# EAGLE design board_1.4(FixMosfetGND)v (EAGLE 7.7.0)
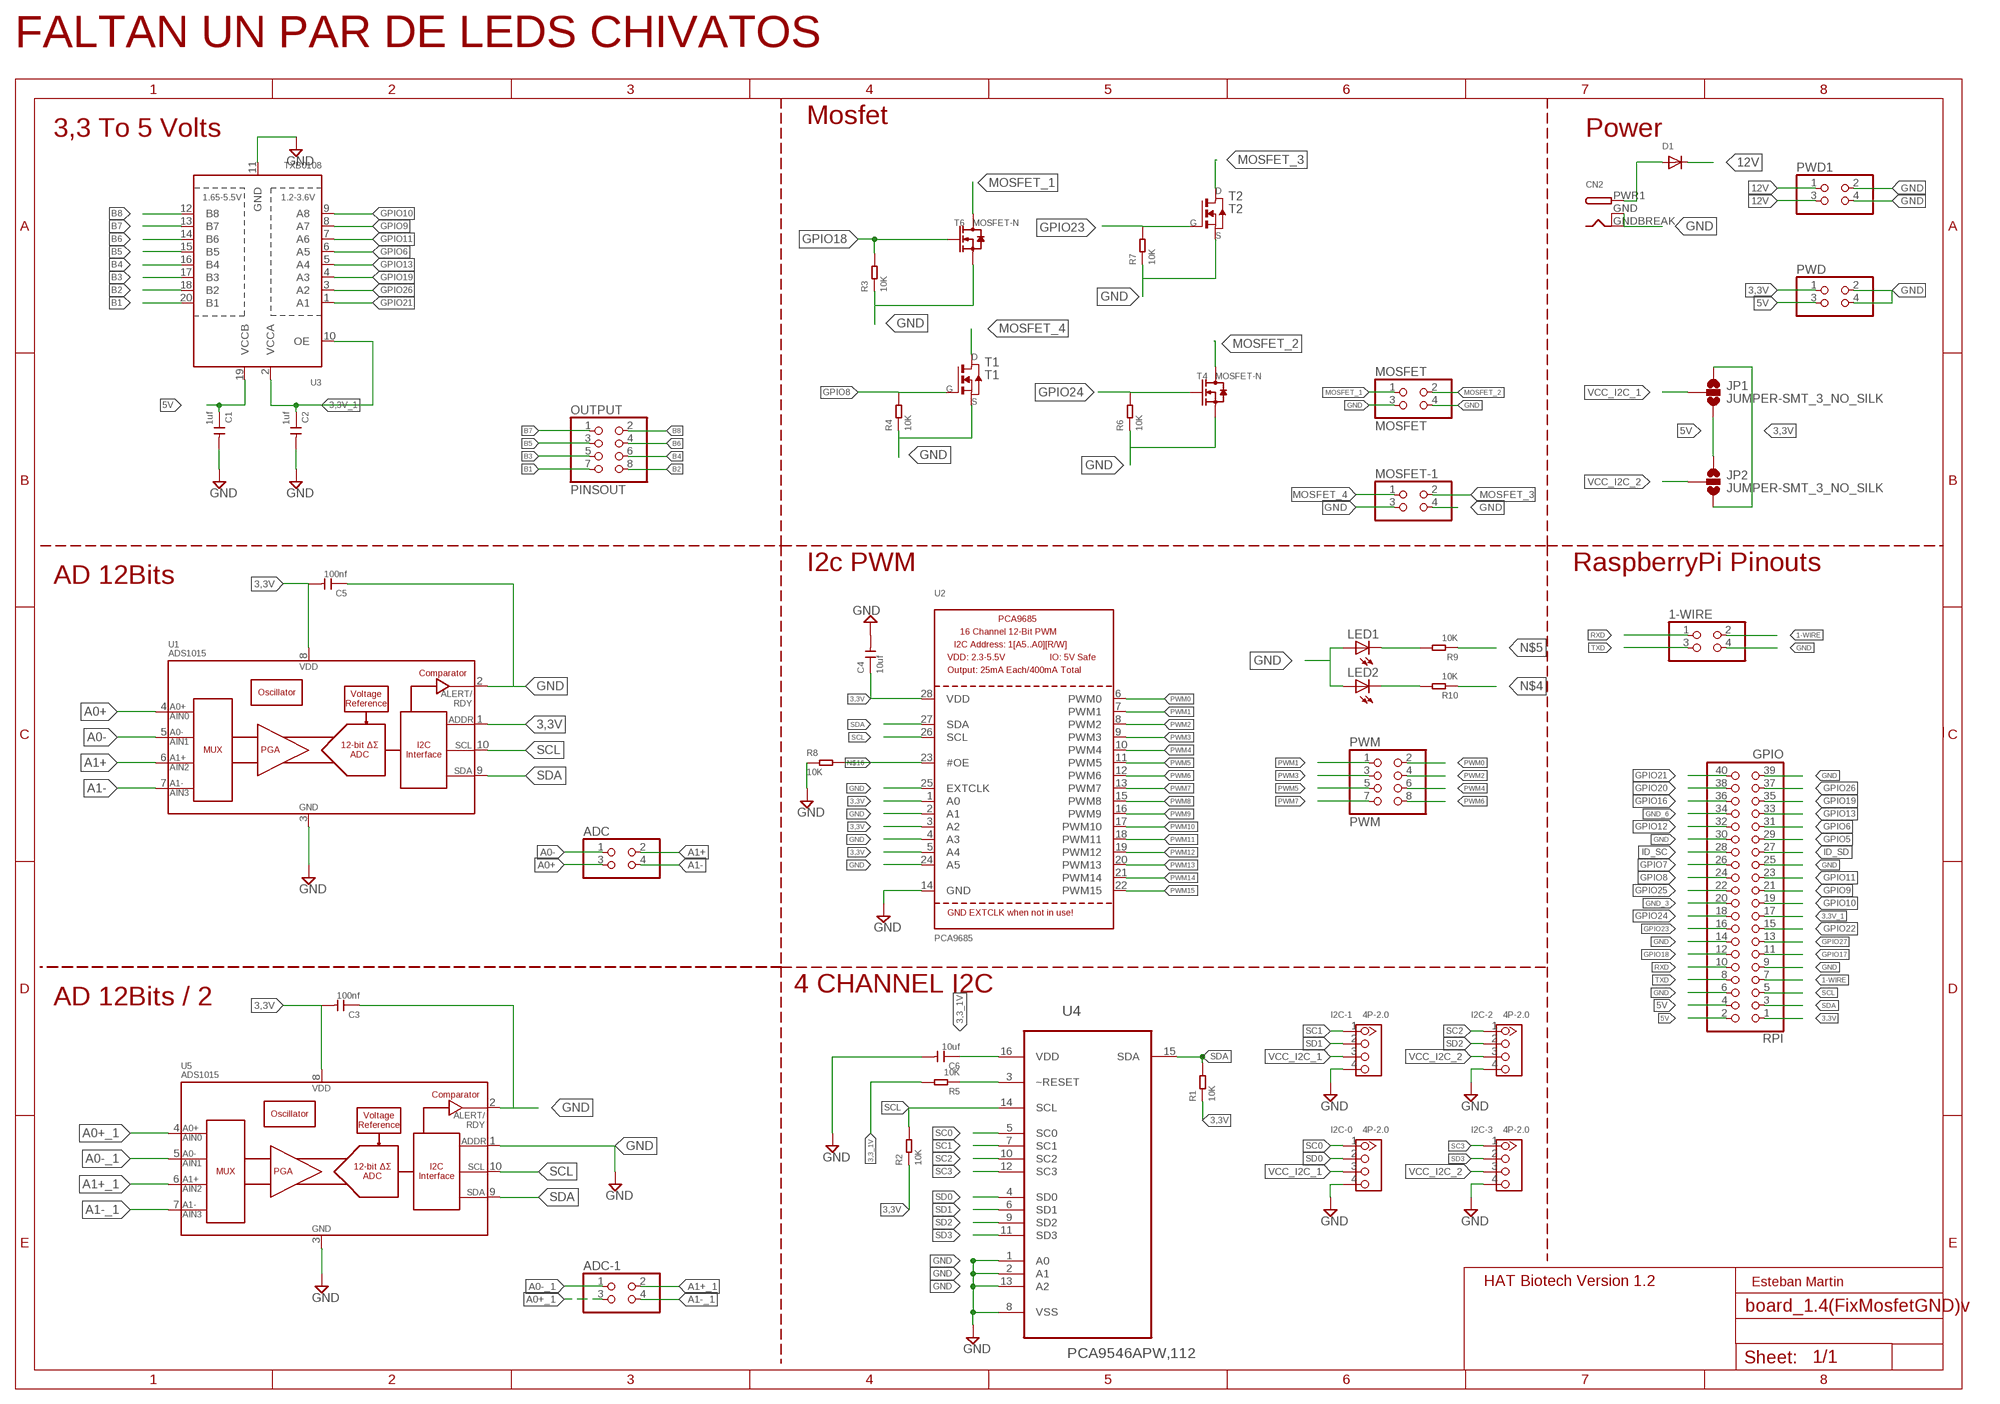
[diagram p0: schematic, sheet 1]

## Parts
1-WIRE  PINHD-2X2  [2X02]
ADC  PINHD-2X2  [2X02]
ADC-1  PINHD-2X2  [2X02]
C1  1uf  CERAMIC-1UF-25V-10%-X7R(0805)  [C0805]
C2  1uf  CERAMIC-1UF-25V-10%-X7R(0805)  [C0805]
C3  100nf  CERAMIC-100NF-50V-10%-X7R(0805)  [C0805]
C4  10uf  CERAMIC-1UF-25V-10%-X7R(0805)  [C0805]
C5  100nf  CERAMIC-100NF-50V-10%-X7R(0805)  [C0805]
C6  10uf  CERAMIC-1UF-25V-10%-X7R(0805)  [C0805]
CN2  DCBARRELSMT  [DCJACK_2MM_SMT]
D1  DIODESOD-123  [SOD-123]
I2C-0  4P-2.0  GROVE-CONNECTOR-DIP(4P-2.0)  [HW4-2.0]
I2C-1  4P-2.0  GROVE-CONNECTOR-DIP(4P-2.0)  [HW4-2.0]
I2C-2  4P-2.0  GROVE-CONNECTOR-DIP(4P-2.0)  [HW4-2.0]
I2C-3  4P-2.0  GROVE-CONNECTOR-DIP(4P-2.0)  [HW4-2.0]
JP1  JUMPER-SMT_3_NO_SILK  [SMT-JUMPER_3_NO_SILK]
JP2  JUMPER-SMT_3_NO_SILK  [SMT-JUMPER_3_NO_SILK]
LED1  LED  [SMARTLED-TTW]
LED2  LED  [SMARTLED-TTW]
MOSFET  MOSFET  PINHD-2X2  [2X02]
MOSFET-1  PINHD-2X2  [2X02]
OUTPUT  PINSOUT  PINHD-2X4  [2X04]
PWD  PINHD-2X2  [2X02]
PWD1  PINHD-2X2  [2X02]
PWM  PWM  PINHD-2X4  [2X04]
R1  10K  SMD-RES-10K-1%-1/8W(0805)  [R0805]
R2  10K  SMD-RES-10K-1%-1/8W(0805)  [R0805]
R3  10K  SMD-RES-10K-1%-1/8W(0805)  [R0805]
R4  10K  SMD-RES-10K-1%-1/8W(0805)  [R0805]
R5  10K  SMD-RES-10K-1%-1/8W(0805)  [R0805]
R6  10K  SMD-RES-10K-1%-1/8W(0805)  [R0805]
R7  10K  SMD-RES-10K-1%-1/8W(0805)  [R0805]
R8  10K  SMD-RES-10K-1%-1/8W(0805)  [R0805]
R9  10K  SMD-RES-10K-1%-1/8W(0805)  [R0805]
R10  10K  SMD-RES-10K-1%-1/8W(0805)  [R0805]
RPI  GPIO  PINHD-2X20  [2X20]
T1  T1  NMOSFETTO252  [TO252]
T2  T2  NMOSFETTO252  [TO252]
T4  MOSFET-N  [SOT-23]
T6  MOSFET-N  [SOT-23]
U1  ADS1015  [MSOP10]
U2  PCA9685  [TSSOP28]
U3  TXB0108  TXB0108PWR  [TSSOP20]
U4  PCA9546APW,112  [SOP65P640X110-16N]
U5  ADS1015  [MSOP10]

## Nets
1-WIRE: 1-WIRE.2 RPI.7
3,3_1V: C6.1 R5.2 U4.16(VDD)
3,3V: C3.2 C4.1 C5.2 JP1.1 JP2.3 PWD.1 R1.1 R2.1 RPI.1 U1.1(ADDR) U1.8(VDD) U2.1(A0) U2.3(A2) U2.5(A4) U2.28(VDD) U5.8(VDD)
3,3V_1: C2.1 RPI.17 U3.2(VCCA) U3.10(OE)
5V: C1.1 JP1.3 JP2.1 PWD.3 RPI.2 RPI.4 U3.19(VCCB)
12V: D1.C PWD1.1 PWD1.3
A0+: ADC.3 U1.4(AIN0)
A0+_1: ADC-1.3 U5.4(AIN0)
A0-: ADC.1 U1.5(AIN1)
A0-_1: ADC-1.1 U5.5(AIN1)
A1+: ADC.2 U1.6(AIN2)
A1+_1: ADC-1.2 U5.6(AIN2)
A1-: ADC.4 U1.7(AIN3)
A1-_1: ADC-1.4 U5.7(AIN3)
B1: OUTPUT.7 U3.20(B1)
B2: OUTPUT.8 U3.18(B2)
B3: OUTPUT.5 U3.17(B3)
B4: OUTPUT.6 U3.16(B4)
B5: OUTPUT.3 U3.15(B5)
B6: OUTPUT.4 U3.14(B6)
B7: OUTPUT.1 U3.13(B7)
B8: OUTPUT.2 U3.12(B8)
GND: 1-WIRE.4 C1.2 C2.2 C3.1 C4.2 C5.1 C6.2 CN2.GND(GNDBREAK) CN2.GNDBREAK(GND) I2C-0.4 I2C-1.4 I2C-2.4 I2C-3.4 LED1.A@1(A) LED2.A@1(A) MOSFET-1.3 MOSFET-1.4 MOSFET.3 MOSFET.4 PWD1.2 PWD1.4 PWD.2 PWD.4 R3.1 R4.1 R6.1 R7.1 R8.1 RPI.6 RPI.9 RPI.14 RPI.25 RPI.30 RPI.39 T1.2(S) T2.2(S) T4.2(S) T6.2(S) U1.2(ALERT/RDY) U1.3(VSS) U2.2(A1) U2.4(A3) U2.14(GND) U2.24(A5) U2.25(EXTCLK) U3.11(GND) U4.1(A0) U4.2(A1) U4.8(VSS) U4.13(A2) U5.1(ADDR) U5.2(ALERT/RDY) U5.3(VSS)
GND_3: RPI.20
GND_6: RPI.34
GPIO5: RPI.29
GPIO6: RPI.31 U3.6(A5)
GPIO7: RPI.26
GPIO8: R4.2 RPI.24 T1.1(G)
GPIO9: RPI.21 U3.8(A7)
GPIO10: RPI.19 U3.9(A8)
GPIO11: RPI.23 U3.7(A6)
GPIO12: RPI.32
GPIO13: RPI.33 U3.5(A4)
GPIO16: RPI.36
GPIO17: RPI.11
GPIO18: R3.2 RPI.12 T6.1(G)
GPIO19: RPI.35 U3.4(A3)
GPIO20: RPI.38
GPIO21: RPI.40 U3.1(A1)
GPIO22: RPI.15
GPIO23: R7.2 RPI.16 T2.1(G)
GPIO24: R6.2 RPI.18 T4.1(G)
GPIO25: RPI.22
GPIO26: RPI.37 U3.3(A2)
GPIO27: RPI.13
ID_SC: RPI.28
ID_SD: RPI.27
MOSFET_1: MOSFET.1 T6.3(D)
MOSFET_2: MOSFET.2 T4.3(D)
MOSFET_3: MOSFET-1.2 T2.3(D)
MOSFET_4: MOSFET-1.1 T1.3(D)
N$1: LED1.C@1(C) R9.2
N$2: CN2.PWR1(PWR) D1.A
N$3: LED2.C@1(C) R10.2
N$4: R10.1
N$5: R9.1
N$7: R5.1 U4.3(~RESET)
N$16: R8.2 U2.23(#OE)
PWM0: PWM.2 U2.6(PWM0)
PWM1: PWM.1 U2.7(PWM1)
PWM2: PWM.4 U2.8(PWM2)
PWM3: PWM.3 U2.9(PWM3)
PWM4: PWM.6 U2.10(PWM4)
PWM5: PWM.5 U2.11(PWM5)
PWM6: PWM.8 U2.12(PWM6)
PWM7: PWM.7 U2.13(PWM7)
PWM8: U2.15(PWM8)
PWM9: U2.16(PWM9)
PWM10: U2.17(PWM10)
PWM11: U2.18(PWM11)
PWM12: U2.19(PWM12)
PWM13: U2.20(PWM13)
PWM14: U2.21(PWM14)
PWM15: U2.22(PWM15)
RXD: 1-WIRE.1 RPI.10
SC0: I2C-0.1 U4.5(SC0)
SC1: I2C-1.1 U4.7(SC1)
SC2: I2C-2.1 U4.10(SC2)
SC3: I2C-3.1 U4.12(SC3)
SCL: R2.2 RPI.5 U1.10(SCL) U2.26(SCL) U4.14(SCL) U5.10(SCL)
SD0: I2C-0.2 U4.4(SD0)
SD1: I2C-1.2 U4.6(SD1)
SD2: I2C-2.2 U4.9(SD2)
SD3: I2C-3.2 U4.11(SD3)
SDA: R1.2 RPI.3 U1.9(SDA) U2.27(SDA) U4.15(SDA) U5.9(SDA)
TXD: 1-WIRE.3 RPI.8
VCC_I2C_1: I2C-0.3 I2C-1.3 JP1.2
VCC_I2C_2: I2C-2.3 I2C-3.3 JP2.2

## Notes on the sheet
- FALTAN UN PAR DE LEDS CHIVATOS
- Mosfet
- 3,3 To 5 Volts | Power
- I2c PWM | RaspberryPi Pinouts
- AD 12Bits
- 4 CHANNEL I2C
- AD 12Bits / 2
- HAT Biotech Version 1.2 | Esteban Martin

## Library data of the parts
1-WIRE ADC ADC-1 MOSFET MOSFET-1 PWD PWD1 = pinhead:PINHD-2X2: PIN HEADER
C1 C2 = Seeed-OPL-Capacitor:CERAMIC-1UF-25V-10%-X7R(0805): 302010179; MPN: CC0805KKX7R8BB105
C3 C5 = Seeed-OPL-Capacitor:CERAMIC-100NF-50V-10%-X7R(0805): 302010165; MPN: CC0805KRX7R9BB104
C4 C6 = Seeed-OPL-Capacitor:CERAMIC-1UF-25V-10%-X7R(0805): 302010179; MPN: CC0805KKX7R8BB105; VALUE: 1uf
CN2 = adafruit:DCBARREL: 2.0mm DC Barrel Jack DCJACK_2MM_PTH - Through Hole Jack (4UConnector: 05537)
D1 = adafruit:DIODE: Diode SMADIODE - SMA Surface Mount Package 20V 1A Schottky Diode Digikey: 641-1014-6-ND DO-1N4148 - Through Hole Small Current Diode SOD-123 20V 1 A (.5mV Vf) Schottky Diode - Digikey: MBRX120TPMSCT-ND SOD-323 10V 570mA (.38mV Vf, 3ns) Schottky Diode - Digikey: ZLLS410CT-ND SOD-523 30V 30mA Schottky Diode (RB751S-40TE61) - Digikey: RB751S-40TE61CT-ND SOT23-R/W - SOT23 Package (R = Solder Paste/Reflow Ovens, W = Hand-Soldering) BAT54Film 40V 300mA - Digikey: 497-7162-1-ND
I2C-0 I2C-1-I2C-3 = Seeed-OPL-Connector:GROVE-CONNECTOR-DIP(4P-2.0): 320110033
JP1 JP2 = SparkFun-Jumpers:JUMPER-SMT_3_NO: Normally open jumper This jumper has three pads in close proximity to each other. Apply solder to close the connection(s).
LED1 LED2 = adafruit:LED: LED OSRAM: - CHIPLED LG R971, LG N971, LY N971, LG Q971, LY Q971, LO R971, LY R971 LH N974, LH R974 LS Q976, LO Q976, LY Q976 LO Q996 - Hyper CHIPLED LW Q18S LB Q993, LB Q99A, LB R99A - SideLED LS A670, LO A670, LY A670, LG A670, LP A670 LB A673, LV A673, LT A673, LW A673 LH A674 LY A675 LS A676, LA A676, LO A676, LY A676, LW A676 LS A679, LY A679, LG A679 - Hyper Micro SIDELED® LS Y876, LA Y876, LO Y876, LY Y876 LT Y87S - SmartLED LW L88C, LW L88S LB L89C, LB L89S, LG L890 LS L89K, LO L89K, LY L89K LS L896, LA L896, LO L896, LY L896 - TOPLED LS T670, LO T670, LY T670, LG T670, LP T670 LSG T670, LSP T670, LSY T670, LOP T670, LYG T670 LG T671, LOG T671, LSG T671 LB T673, LV T673, LT T673, LW T673 LH T674 LS T676, LA T676, LO T676, LY T676, LB T676, LH T676, LSB T676, LW T676 LB T67C, LV T67C, LT T67C, LS T67K, LO T67K, LY T67K, LW E67C LS E67B, LA E67B, LO E67B, LY E67B, LB E67C, LV E67C, LT E67C LW T67C LS T679, LY T679, LG T679 LS T770, LO T770, LY T770, LG T770, LP T770 LB T773, LV T773, LT T773, LW T773 LH T774 LS E675, LA E675, LY E675, LS T675 LS T776, LA T776, LO T776, LY T776, LB T776 LHGB T686 LT T68C, LB T68C - Hyper Mini TOPLED® LB M676 - Mini TOPLED Santana® LG M470 LS M47K, LO M47K, LY M47K Source: http://www.osram.convergy.de/
OUTPUT PWM = adafruit:PINHD-2X4: PIN HEADER
R1-R10 = Seeed-OPL-Resistor:SMD-RES-10K-1%-1/8W(0805): 301010361; MPN: RC0805FR-0710KL
RPI = adafruit:PINHD-2X20: PIN HEADER
T1 T2 = fab_2:NMOSFET: MOS FET
T4 T6 = Seeed-OPL-Transistor:MOSFET-N
U1 U5 = SparkFun-IC-Conversion:ADS1015: ADS1015 12-BIT ADC 12-Bit Del-Sig ADC Four single-ended inputs or two differential inputs Internal PGA I2C interface 2.0-5.5V SparkFun Products SparkFun Block for Intel Edison - ADC <https://www.sparkfun.com/products/13770> (DEV-13770); PROD_ID: IC-12270
U2 = adafruit:PCA9685: PCA9685 - 16 Channel 12-Bit I2C PWM Controller 5.0V tolerant 16 channel, 12-bit I2C PWM controller with 25mA per output (max. 400mA total) Digikey: 568-5931-1-ND
U3 = adafruit:TXB0108PWR: 8-Bit Bi-Directional Level Shifter 1.2V-3.6V (VCCA) to 1.65V-5.5V (VCCB) bi-directional level shifter with auto direction sensing. Max data rate - VCCA 1.8V: 20Mbps (50ns), VCCA 3.3V: 100Mbps (10ns) Digikey: 296-21527-1-ND
U4 = NXP_By_element14_Batch_1:PCA9546APW,112: 4-channel I2C-bus switch with reset; MPN: PCA9546APW,112; OC_FARNELL: 1831208; OC_NEWARK: 70R6610; PACKAGE: TSSOP-16; SUPPLIER: NXP

## Board
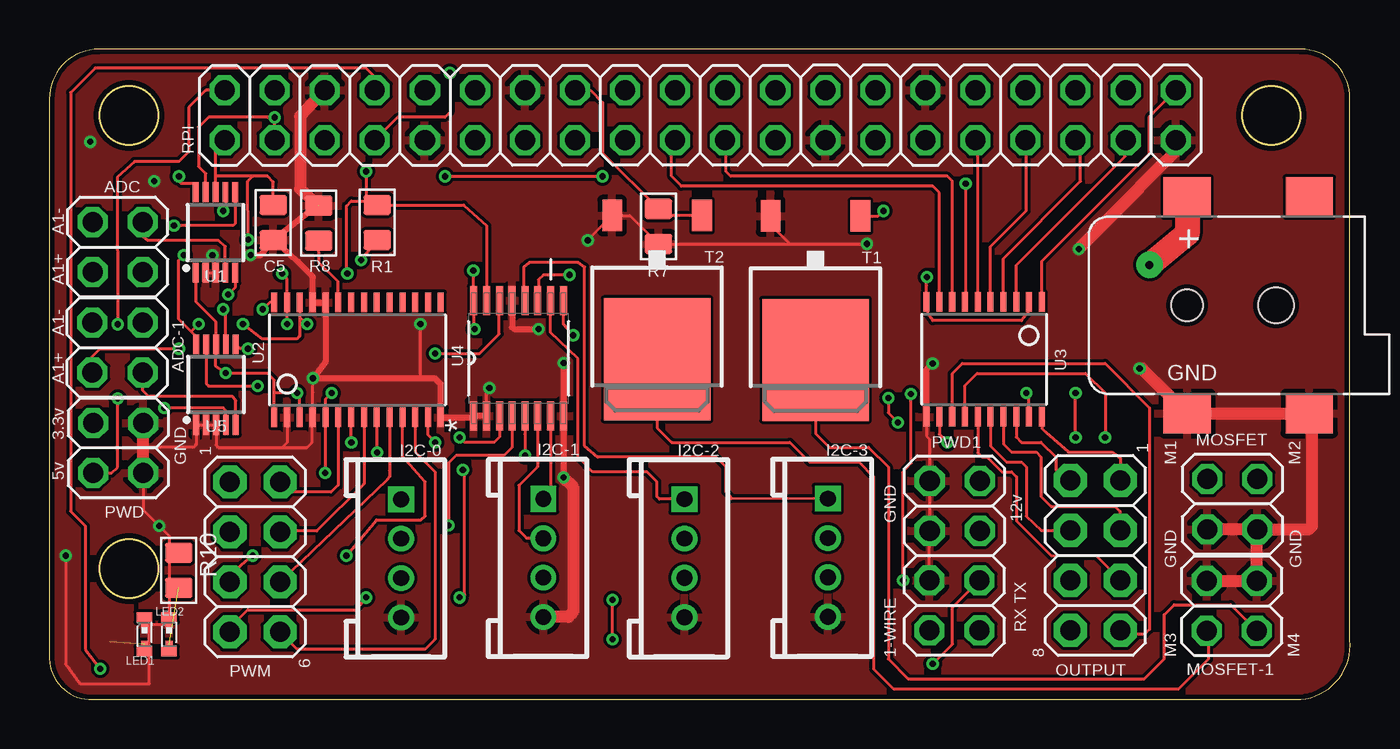
[diagram p1: board, top side]
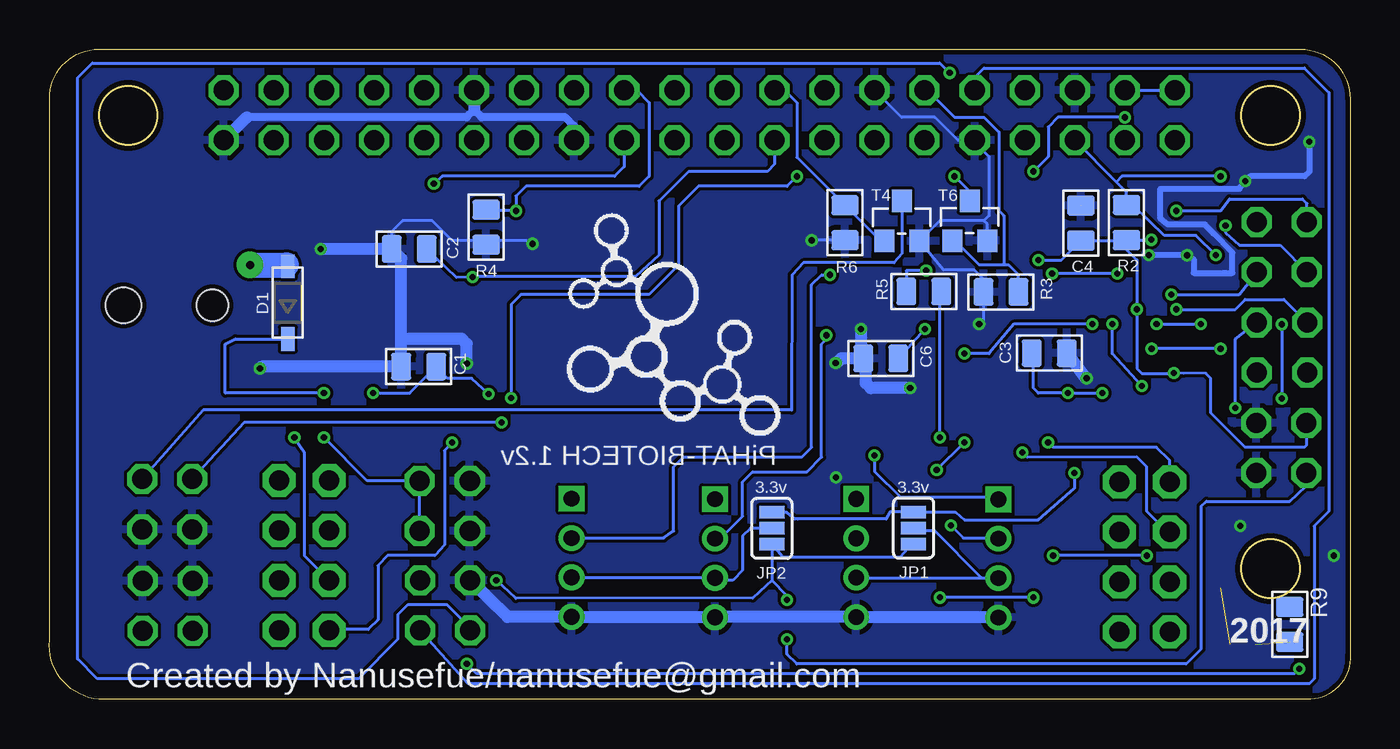
[diagram p2: board, bottom side, seen from below]

Size 66.01 x 33 mm. Coordinates in mm from the lower left corner, seen from the top.
Outline: 0,30.5 0,2.25 arc90 2,0 63.5,0 arc90 66,3 66,30.5 arc90 63.5,33 2.5,33 arc90 0,30.5
Outline: circle at 62.01,29.64 radius 1.48
Outline: circle at 4.05,29.64 radius 1.48
Outline: circle at 4.05,6.63 radius 1.48
Copper layers (1*16): Top 0.035mm / dielectric 1.5mm / Bottom 0.035mm
Design rules "SeeedStudio_2layer_DRU_no_angle_20140221": minimum track width 6mil, minimum drill 12mil, track to track 6mil, track to pad 6mil, pad to pad 6mil, via to via 6mil, smd to smd 0mil, copper to edge 10mil, drill to drill 10mil, minimum pad ring 10mil, minimum via ring 6mil, stop-mask expansion 2mil, vias tented up to drill 100mil, thermal gap 10mil

### Footprints (pad centres in the part's own frame; a part is rotated, then mirrored left to right if it is on the bottom)
2X02 = drill 1.016 octagon: 1 -1.27,-1.27; 2 -1.27,1.27; 3 1.27,-1.27; 4 1.27,1.27
C0805 = smd 1.397 x 1.016: 1 0,0.889; 2 0,-0.889
DCJACK_2MM_SMT = smd 2.4 x 2: GND 0,-5.5; GNDBREAK 6.2,-5.5; PWR1 0,5.5; PWR2 6.2,5.5 | hole 1.6: 0,0 | hole 1.8: 4.5,0
SOD-123 = smd 1.2 x 0.7: A 1.85,0; C -1.85,0
HW4-2.0 = drill 0.8 pad 1.27 square: 1 -3,0 | drill 0.8 pad 1.27: 2 -1,0; 3 1,0; 4 3,0
SMT-JUMPER_3_NO_SILK = smd 0.635 x 1.27: 1 -0.813,0; 2 0,0; 3 0.813,0
SMARTLED-TTW = smd 0.8 x 0.5: A 0,-0.875; C 0,0.875 | smd 0.35 x 0.35: A@1 0,-0.5; C@1 0,0.5
2X04 = drill 1.016 pad 1.676 octagon: 1 -3.81,-1.27; 2 -3.81,1.27; 3 -1.27,-1.27; 4 -1.27,1.27; 5 1.27,-1.27; 6 1.27,1.27; 7 3.81,-1.27; 8 3.81,1.27
R0805 = smd 1.397 x 1.016: 1 0,0.889; 2 0,-0.889
2X20 = drill 1.016 octagon: 1 -24.13,-1.27; 2 -24.13,1.27; 3 -21.59,-1.27; 4 -21.59,1.27; 5 -19.05,-1.27; 6 -19.05,1.27; 7 -16.51,-1.27; 8 -16.51,1.27; 9 -13.97,-1.27; 10 -13.97,1.27; 11 -11.43,-1.27; 12 -11.43,1.27; 13 -8.89,-1.27; 14 -8.89,1.27; 15 -6.35,-1.27; 16 -6.35,1.27; 17 -3.81,-1.27; 18 -3.81,1.27; 19 -1.27,-1.27; 20 -1.27,1.27; 21 1.27,-1.27; 22 1.27,1.27; 23 3.81,-1.27; 24 3.81,1.27; 25 6.35,-1.27; 26 6.35,1.27; 27 8.89,-1.27; 28 8.89,1.27; 29 11.43,-1.27; 30 11.43,1.27; 31 13.97,-1.27; 32 13.97,1.27; 33 16.51,-1.27; 34 16.51,1.27; 35 19.05,-1.27; 36 19.05,1.27; 37 21.59,-1.27; 38 21.59,1.27; 39 24.13,-1.27; 40 24.13,1.27
TO252 = smd 1 x 1.6: 1 -2.28,-4.8; 2 2.28,-4.8 | smd 5.4 x 6.2: 3 0,2.5
SOT-23 = smd 1.016 x 1.143: 1 -0.889,-1.016; 2 0.889,-1.016; 3 0,1.016
MSOP10 = smd 0.3 x 1: 1 -1,-2.05; 2 -0.5,-2.05; 3 0,-2.05; 4 0.5,-2.05; 5 1,-2.05; 6 1,2.05; 7 0.5,2.05; 8 0,2.05; 9 -0.5,2.05; 10 -1,2.05
TSSOP28 = smd 0.305 x 0.991: 1 -4.225,-2.918; 2 -3.575,-2.918; 3 -2.925,-2.918; 4 -2.275,-2.918; 5 -1.625,-2.918; 6 -0.975,-2.918; 7 -0.325,-2.918; 8 0.325,-2.918; 9 0.975,-2.918; 10 1.625,-2.918; 11 2.275,-2.918; 12 2.925,-2.918; 13 3.575,-2.918; 14 4.225,-2.918; 15 4.225,2.918; 16 3.575,2.918; 17 2.925,2.918; 18 2.275,2.918; 19 1.625,2.918; 20 0.975,2.918; 21 0.325,2.918; 22 -0.325,2.918; 23 -0.975,2.918; 24 -1.625,2.918; 25 -2.275,2.918; 26 -2.925,2.918; 27 -3.575,2.918; 28 -4.225,2.918
TSSOP20 = smd 0.305 x 0.991: 1 -2.925,-2.918; 2 -2.275,-2.918; 3 -1.625,-2.918; 4 -0.975,-2.918; 5 -0.325,-2.918; 6 0.325,-2.918; 7 0.975,-2.918; 8 1.625,-2.918; 9 2.275,-2.918; 10 2.925,-2.918; 11 2.925,2.918; 12 2.275,2.918; 13 1.625,2.918; 14 0.975,2.918; 15 0.325,2.918; 16 -0.325,2.918; 17 -0.975,2.918; 18 -1.625,2.918; 19 -2.275,2.918; 20 -2.925,2.918
SOP65P640X110-16N = smd 1.473 x 0.356: 1 -2.921,2.286; 2 -2.921,1.626; 3 -2.921,0.965; 4 -2.921,0.33; 5 -2.921,-0.33; 6 -2.921,-0.965; 7 -2.921,-1.626; 8 -2.921,-2.286; 9 2.921,-2.286; 10 2.921,-1.626; 11 2.921,-0.965; 12 2.921,-0.33; 13 2.921,0.33; 14 2.921,0.965; 15 2.921,1.626; 16 2.921,2.286

### Placement (x,y rotation side)
1-WIRE  45.93,4.76 90 top
ADC  3.47,22.96 90 top
ADC-1  3.46,17.86 90 top
C1  47.27,16.89 270 bottom
C2  47.75,22.87 270 bottom
C3  15.27,17.57 270 bottom
C4  13.67,24.18 180 bottom
C5  11.37,24.2 180 top
C6  23.82,17.31 270 bottom
CN2  57.74,20 0 top
D1  53.91,20.14 90 bottom
I2C-0  17.85,7.16 270 top
I2C-1  25.07,7.18 270 top
I2C-2  32.23,7.16 270 top
I2C-3  39.51,7.19 270 top
JP1  22.16,8.7 270 bottom
JP2  29.35,8.68 90 bottom
LED1  4.83,3.3 180 top
LED2  6.08,3.3 180 top
MOSFET  60.03,9.91 270 top
MOSFET-1  60,4.75 90 top
OUTPUT  53.09,7.31 90 top
PWD  3.5,12.76 270 top
PWD1  45.94,9.83 90 top
PWM  10.44,7.23 270 top
R1  16.64,24.21 180 top
R2  11.35,24.2 180 bottom
R3  17.72,20.69 90 bottom
R4  43.84,23.97 180 bottom
R5  21.64,20.71 270 bottom
R6  25.64,24.19 180 bottom
R7  30.91,24.01 180 top
R8  13.68,24.17 0 top
R9  3.08,3.8 0 bottom
R10  6.58,6.55 0 top
RPI  33.03,29.65 0 top
T1  38.88,19.73 180 top
T2  30.84,19.76 180 top
T4  22.75,24.28 0 bottom
T6  19.31,24.3 0 bottom
U1  8.44,23.7 0 top
U2  15.64,17.24 0 top
U3  47.44,17.26 180 top
U4  23.81,17.32 90 top
U5  8.46,15.98 0 top

### Tracks (layer width: path | path; a pad name or v marks a point on that pad's centre or on a via)
1-WIRE  (via drill 0.31)
  Top 0.16: v20.33,31.8 20.33,29.8 20.08,29.55 17.69,29.55 RPI.7
  Bottom 0.16: 1-WIRE.2 44.66,3.63 45.83,4.8 47.83,4.8 48.33,4.3 48.33,3.05 50.33,1.05 63.58,1.05 64.58,2.05 64.58,31.55 63.83,32.3 20.83,32.3 v20.33,31.8
3,3_1V  (via drill 0.31)
  Top 0.16: v21.58,18.8 21.53,19.1 U4.16 21.53,21.6 v21.52,21.78
  Bottom 0.16: v21.58,18.8 C6.1 | v21.52,21.78 22.53,21.77 R5.2
3,3V  (via drill 0.31)
  Top 0.16: U1.8 8.44,26.55 | 8.44,26.55 8.44,27.92 RPI.1 | U1.1 7.44,20.19 8.46,19.16 U5.8 8.45,16.92 v8.95,16.57 8.97,16.55 11.08,16.55 11.42,16.21 11.42,15.55 | U2.1 11.42,15.55 | U2.3 12.72,15.41 v12.58,15.55 11.42,15.55 | v14.33,15.55 14.02,15.24 U2.5 14,14.25 v14,11.49 | U2.28 11.18,20.16 v10.83,19.8 | C5.2 11.37,26.26 11.08,26.55 10.33,26.55 | 10.33,26.55 8.44,26.55 | v10.09,23.33 10.08,26.3 10.33,26.55 | R1.1 16.08,22.6 v15.83,22.3
  Bottom 0.16: JP2.3 28.58,9.49 28.18,9.15 28.04,9.15 23.56,9.16 23.37,9.51 JP1.1 20.04,9.51 19.58,9.12 15.83,9.12 14.01,10.7 v14,11.49 | C3.2 16.08,17.49 16.08,15.8 15.83,15.55 v14.33,15.55 v12.58,15.55 | v8.95,16.57 7.33,16.55 7.08,16.3 7.08,14.55 5.33,12.8 2.33,12.8 2.23,12.9 PWD.1 | 8.47,16.55 v8.95,16.57 | v8.95,16.57 8.97,16.55 10.58,16.55 10.83,16.8 v10.83,19.8 10.83,22.3 11.35,22.83 R2.1 | R2.1 11.38,23.29 C4.1 14.66,22.3 v15.83,22.3 | R2.1 10.31,23.31 v10.09,23.33
3,3V_1  (via drill 0.31)
  Top 0.16: v44.53,21.43 44.51,20.99 U3.10 44.58,20.11 44.58,19.55 44.83,19.23 49.33,19.22 49.71,19.69 U3.2
  Bottom 0.16: C2.1 45.36,21.42 v44.53,21.43 44.46,21.46 36.27,21.46 35.08,22.55 35.08,25.3 33.58,26.8 29.58,26.8 29.22,27.16 RPI.17
5V  (via drill 0.31)
  Top 0.16: U3.19 49.71,15.41 v49.58,15.55 | RPI.2 7.95,30.92 7.08,30.05 7.08,27.8 6.58,27.3 4.33,27.3 3.45,26.5 v3.47,19.04 | v43.33,6.05 43.33,11.55 43.73,12 v43.73,15.5 | v28.58,3.05 v28.58,5.05 | v3.47,15.28 3.47,11.78 3.17,11.49 PWD.3
  Bottom 0.16: JP1.3 22.24,7.88 22.85,7.2 28.8,7.2 JP2.1 29.35,6.03 | v49.58,15.55 47.72,15.55 C1.1 45.8,16.3 44.58,16.3 v43.73,15.5 | RPI.4 RPI.2 | v3.47,19.04 v3.47,15.28 | 29.35,6.03 30.32,5.15 42.33,5.12 v43.33,6.05 | v28.58,3.05 28.58,2.3 28.08,1.8 8.33,1.8 7.58,2.55 7.58,9.8 7.3,10.06 3.08,10.05 2.23,10.83 PWD.3 | v28.58,5.05 28.58,5.26 29.35,6.03
12V  (via drill 0.31)
  Top 0.16: v52.08,13.3 v52.08,15.55
  Bottom 0.16: v52.08,13.3 49.88,11.1 PWD1.3 PWD1.1 | v52.08,15.55 57.08,15.55 57.08,18.05 56.58,18.3 D1.C | 53.83,18.3 D1.C | D1.C
A0+
  Top 0.16: U1.4 8.93,22.99 8.59,23.29 5.02,23.29 4.73,23.55 ADC.3
A0+_1  (via drill 0.31)
  Top 0.16: U5.4 8.96,14.66 8.83,14.8 v5.83,14.8
  Bottom 0.16: v5.83,14.8 5.83,18.28 ADC-1.3
A0-  (via drill 0.31)
  Top 0.16: U1.5 9.44,20.91 v9.08,20.55
  Bottom 0.16: v9.08,20.55 5.63,20.55 ADC.1
A0-_1
  Top 0.16: U5.5 9.46,15.16 9.29,15.38 5.04,15.38 4.74,15.68 ADC-1.1
A1+  (via drill 0.31)
  Top 0.16: U1.6 9.44,24.16 9.33,24.05 v6.33,24.05
  Bottom 0.16: v6.33,24.05 6.33,23.7 5.63,23.05 3.56,23.05 ADC.2
A1+_1  (via drill 0.31)
  Top 0.16: ADC-1.2 2.19,17.41 2.58,17.8 v6.58,17.8 | v10.08,17.8 9.7,17.8 U5.6
  Bottom 0.16: v6.58,17.8 v10.08,17.8
A1-  (via drill 0.31)
  Top 0.16: U1.7 8.94,24.94 v8.83,24.8
  Bottom 0.16: ADC.4 2.2,25.17 2.43,25.4 6.13,25.4 6.58,24.8 v8.83,24.8
A1-_1  (via drill 0.31)
  Top 0.16: U5.7 8.96,19.66 v8.83,19.8
  Bottom 0.16: v8.83,19.8 5.83,19.8 5.33,20.3 3.36,20.3 ADC-1.4
B1
  Top 0.16: U3.20 50.37,13.75 50.45,13.67 50.58,13.55 51.71,12.55 53.92,12.56 54.34,12.24 54.33,11.15 OUTPUT.7
B2
  Top 0.16: U3.18 49.06,13.31 49.33,13.05 50.33,13.05 51.08,12.3 51.08,11.63 OUTPUT.8
B3
  Top 0.16: U3.17 48.41,12.96 48.83,12.55 50.08,12.55 50.33,12.3 50.33,10.3 50.83,9.8 54.08,9.8 54.33,9.55 54.33,8.61 OUTPUT.5
B4
  Top 0.16: U3.16 47.76,12.86 48.58,12.05 49.33,12.05 49.58,11.8 49.58,9.3 50.33,8.58 51.76,8.58 OUTPUT.6
B5
  Top 0.16: U3.15 47.11,12.51 47.33,12.3 47.58,12.3 48.33,11.55 48.83,11.55 49.08,11.3 49.08,9.05 49.83,8.3 50.85,7.29 51.58,7.3 53.1,7.3 OUTPUT.3
B6  (via drill 0.31)
  Top 0.16: U3.14 46.46,15.94 47.08,16.55 52.58,16.55 53.58,15.55 v53.58,13.3
  Bottom 0.16: v53.58,13.3 53.08,12.55 53.08,7.3 OUTPUT.4
B7
  Top 0.16: U3.13 45.81,16.54 46.33,17.05 53.58,17.05 55.83,14.8 55.83,3.55 55.58,3.3 54.56,3.3 OUTPUT.1
B8  (via drill 0.31)
  Top 0.16: U3.12 45.16,13.46 v45.58,13.05
  Bottom 0.16: v45.58,13.05 45.96,12.64 45.96,7.83 46.44,7.3 48.85,7.3 49.33,6.8 49.33,4.05 49.83,3.55 51.77,3.55 OUTPUT.2
GND  (via drill 0.31, 0.32)  (1 unrouted)
  Top 0.16: v13.38,16.3 13.37,15.59 U2.4 13.33,14.28 13.33,13.05 13.08,12.8 11.83,12.8 | 11.83,12.8 8.58,12.8 8.46,12.91 U5.3 U5.2 U5.1 7.46,12.94 7.33,12.8 4.77,12.8 | U1.2 U1.3 8.44,22.41 v8.28,22.54 | U2.2 12.07,13.04 11.83,12.8 | v22.33,15.8 22.19,15.66 U4.2 | v18.83,19.05 18.83,16.3 | 37.58,23.12 R7.1 29.46,24.56 T2.2 27.3,23.3 v27.33,23.3 | 37.58,23.12 v41.5,23.12 | T1.2 36.6,24.1 37.58,23.12 | 1-WIRE.4 44.66,8.54 PWD1.2 PWD1.4 44.67,13.2 44.51,13.36 U3.11 | LED1.A@1 5.08,3.8 | 5.08,3.8 LED2.A@1 6.08,8.3 v5.58,8.8 4.77,9.61 PWD.4 | v0.83,7.3 0.83,1.8 1.58,0.8 5.08,0.8 5.08,3.8
  Top 0.3: v26.1,11.28 U4.8 26.11,14.45 v26.11,17.08 | U4.13 23.48,18.9 23.58,18.8 v24.83,18.8 | U4.2 U4.1 21.45,14.32 U2.14 19.87,16.01 19.58,16.3 18.83,16.3 v13.38,16.3 14.02,17.12 U2.24 U2.25 13.37,21.41 13.37,21.46 12.61,22.23 11.44,23.32 | v10.23,22.55 10.72,22.55 C5.1 13.61,25.08 | U3.11 44.51,16.74 v44.83,17.05
  Top 0.6: v26.1,11.28 v26.09,11.28 26.58,10.8 26.58,4.43 26.33,4.18 I2C-1.4 | v55.33,16.8 55.44,16.8 CN2.GND CN2.GNDBREAK 64.08,14.37 64.08,8.8 63.92,8.64 MOSFET.4 | v52.24,22.87 56.38,27.05 57.11,27.78 RPI.39 | MOSFET.4 MOSFET.3 | MOSFET-1.4 MOSFET-1.3 61.27,8.61 MOSFET.4 | RPI.6 13.98,30.95 12.73,29.6 12.73,25.91 R8.1 13.61,25.08 | 11.44,23.32 C5.1 | PWD.4 4.77,12.8 PWD.2
  Bottom 0.16: RPI.14 22.77,29.55 21.08,29.55 19.91,28.38 RPI.9 19.06,28.28 18.33,27.55 18.33,24.55 18.58,24.3 | v18.83,19.05 18.61,19.27 R3.1 18.61,21.33 19.08,21.8 20.65,21.8 T4.2 20.83,24.3 18.58,24.3 | C2.2 48.64,23.74 48.08,24.3 46.58,24.3 45.58,23.3 44.07,23.3 R4.1 43.8,23.08 43.58,23.3 41.83,23.3 v41.5,23.12 | T6.2 18.42,24.14 18.58,24.3 | R6.1 27.07,23.3 v27.33,23.3
  Bottom 0.3: v10.23,22.55 v8.28,22.54 7.94,22.34 U1.2 6.43,21.65 6.33,21.65 5.98,21.65 5.97,22.68 6.96,23.66 7.08,23.8 7.37,24.1 9.27,24.1 9.63,24.4 9.63,25.92 5.63,25.92 v5.33,26.3 5.08,26.55 2.33,26.55 2.08,26.8 v2.08,28.3
  Bottom 0.406: 55.99,29.55 44.83,29.55 44.46,29.92 44.09,29.55 39.83,29.55 39.38,29.1 RPI.25
  Bottom 0.6: I2C-0.4 25.05,4.16 I2C-1.4 32.21,4.18 I2C-2.4 39.43,4.17 I2C-3.4 42.77,4.19 1-WIRE.4 | v55.33,16.8 55.24,16.89 C1.2 48.16,18.3 | v52.24,22.87 C2.2 48.16,22.39 48.16,18.3 | v13.38,16.3 14.33,17.52 C3.1 | C6.2 25.82,17.31 v26.11,17.08 | RPI.30 44.46,29.92 | 55.99,29.55 RPI.39 | v24.83,18.8 24.83,17.43 C6.2 | v22.33,15.8 24.33,15.8 24.58,16.05 24.58,17.18 C6.2 | v44.83,17.05 44.83,18.05 45.08,18.3 48.16,18.3
  pour Bottom: 2.67,33.7 64.31,33.45 arc-91 66.53,30.54 66.32,1.99 arc-89 63.84,-0.48 4.03,-1.4 arc-90 -0.51,1.92 -0.69,30.49 arc-90
  pour Top: 2.43,33.57 64.75,33.59 arc-91 66.55,30.42 66.61,2.02 arc-89 64.11,-0.44 1.81,-1.98 arc-90 -0.62,1.87 -0.64,29.07 arc-90
GPIO6
  Top 0.16: U3.6 47.11,28.26 RPI.31
GPIO8  (via drill 0.31)
  Top 0.16: T1.1 42.06,24.53 v42.33,24.8
  Bottom 0.16: R4.2 43.79,24.8 v42.33,24.8 42.33,25.55 41.83,26.05 36.08,26.05 35.58,26.55 35.58,30.3 36.2,30.92 RPI.24
GPIO9
  Top 0.16: U3.8 45.81,26.31 45.58,26.55 34.58,26.55 34.33,26.8 34.33,28.35 RPI.21
GPIO10
  Top 0.16: U3.9 45.16,25.71 44.83,26.05 32.08,26.05 31.58,26.55 31.58,28.2 RPI.19
GPIO11  (via drill 0.31)
  Top 0.16: v46.5,26.18 46.49,20.12 U3.7
  Bottom 0.16: RPI.23 36.84,27.04 37.33,26.55 46.08,26.55 v46.5,26.18
GPIO13
  Top 0.16: U3.5 47.76,22.99 49.58,24.8 49.58,28.34 RPI.33
GPIO18
  Bottom 0.16: R3.2 16.83,21.55 17.33,22.05 17.58,22.05 | 17.58,22.05 18.83,22.05 19.83,23.05 19.97,23.05 T6.1 | RPI.12 21.45,30.92 20.08,29.55 18.58,29.55 17.83,28.8 17.83,24.8 17.58,24.55 17.58,22.05
GPIO19
  Top 0.16: U3.4 48.41,22.39 52.33,26.3 52.33,28.13 RPI.35
GPIO21
  Top 0.16: U3.1 50.36,22.24 55.83,27.7 55.83,29.59 RPI.40
GPIO23
  Top 0.16: T2.1 31.24,24.56 R7.2 28.08,27.73 28.08,30.3 27.46,30.92 RPI.16
GPIO24
  Bottom 0.16: RPI.18 28.7,30.92 28.08,30.3 28.08,27.52 R6.2 23.82,23.27 T4.1
GPIO26
  Top 0.16: U3.3 49.06,22.04 54.58,27.55 54.58,28.34 RPI.37
MOSFET_1  (via drill 0.31)
  Top 0.16: v20.08,26.55 v28.08,26.55 | v42.58,15.3 42.58,14.55 v43.06,14.06
  Bottom 0.16: T6.3 19.31,25.78 v20.08,26.55 | v28.08,26.55 28.58,26.05 33.08,26.05 34.08,25.05 34.08,22.05 35.58,20.55 42.08,20.55 42.58,20.05 v42.58,15.3 | v43.06,14.06 56.13,14.06 MOSFET.1
MOSFET_2
  Bottom 0.16: T4.3 22.75,22.63 23.15,22.17 27.75,22.17 28.33,21.55 28.34,14.69 58.2,14.69 MOSFET.2
MOSFET_3
  Top 0.16: T2.3 30.84,13.79 31.58,13.05 37.58,13.05 38.58,12.05 41.08,12.05 41.83,11.3 41.83,1.55 42.83,0.55 57.33,0.55 58.83,2.05 58.83,3.39 MOSFET-1.2
MOSFET_4
  Top 0.16: T1.3 38.88,13.5 39.58,12.8 41.58,12.8 42.58,11.8 42.58,2.05 43.58,1.05 55.58,1.05 56.58,2.05 56.58,4.3 57.08,4.8 59.95,4.8 MOSFET-1.1
N$1  (1 unrouted)
N$2  (via drill 0.4 pad 1.35)
  Top 1.27: CN2.PWR1 57.74,23.64 v55.83,22.05
  Bottom 0.6: 53.99,22.05 D1.A
  Bottom 1.27: v55.83,22.05 53.99,22.05
N$3  (1 unrouted)
N$7  (via drill 0.31)
  Top 0.16: U4.3 22.85,13.32 22.58,13.05 21.08,13.05 v20.83,13.3
  Bottom 0.16: v20.83,13.3 20.83,20.63 R5.1
N$16
  Top 0.16: U2.23 14.66,21.22 13.69,22.14 R8.2
PWM0
  Top 0.16: U2.6 14.67,10.88 14.3,10.52 12.16,10.52 PWM.2
PWM1  (via drill 0.31)
  Top 0.16: v15.33,13.05 U2.7
  Bottom 0.16: PWM.1 9.17,12.14 9.83,12.8 15.08,12.8 v15.33,13.05
PWM2
  Top 0.16: U2.8 15.97,10.94 13.58,8.55 11.76,8.55 PWM.4
PWM3  (via drill 0.31)
  Top 0.16: v16.63,12.53 16.63,14.09 U2.9
  Bottom 0.16: PWM.3 9.28,8.5 10.33,9.55 10.33,11.8 10.83,12.3 16.39,12.29 v16.63,12.53
PWM4
  Top 0.16: U2.10 17.27,11.62 17.27,11.28 17.14,11.13 PWM.6
PWM5  (via drill 0.31)
  Top 0.16: PWM.5 9.17,6.29 v10.33,7.3 | v15.08,7.3 16.61,9.12 18.86,9.12 19.08,9.3 19.08,11.05 17.93,12.34 17.93,14.27 U2.11
  Bottom 0.16: v10.33,7.3 v15.08,7.3
PWM6
  Top 0.16: U2.12 18.57,12.56 19.58,11.55 19.58,3.05 19.08,2.55 12.58,2.55 PWM.8
PWM7  (via drill 0.31)
  Top 0.16: PWM.7 9.17,3.64 10.08,4.55 15.58,4.55 v16.08,5.17 | v20.83,5.17 21.08,5.3 21.08,11.55 v20.99,11.64 | v19.58,13.05 19.23,13.42 19.22,14.19 U2.13
  Bottom 0.16: v16.08,5.17 v20.83,5.17 | v20.99,11.64 v19.58,13.05
RXD
  Bottom 0.16: RPI.10 19.06,31.57 18.58,32.05 2.33,32.05 1.08,30.8 1.08,9.55 1.83,8.8 1.83,1.05 2.08,0.8 44.75,0.8 1-WIRE.1
SC0  (via drill 0.31)
  Top 0.16: U4.5 24.14,13.46 v24.14,12.39
  Bottom 0.16: v24.14,12.39 24.14,11.57 22.83,10.27 17.73,10.28 I2C-0.1
SC1
  Top 0.16: U4.7 25.44,10.55 I2C-1.1
SC2
  Top 0.16: I2C-2.1 30.96,10.17 30.83,10.3 30.83,11.05 30.33,11.55 27.58,11.55 26.83,12.3 26.83,17.3 25.44,18.61 25.44,19.94 U4.10
SC3
  Top 0.16: I2C-3.1 34.61,10.2 34.33,10.55 34.33,11.8 33.83,12.3 27.83,12.3 27.16,12.87 27.17,21.95 26.86,22.16 24.36,22.16 24.08,21.95 24.08,20.3 U4.12
SCL  (via drill 0.31)
  Top 0.16: U1.10 7.44,26.19 6.69,26.19 6.58,26.3 v6.58,26.55 | U5.10 7.46,18.41 7.2,18.68 | 7.2,18.68 6.58,19.3 6.58,22.3 v6.83,22.55 | v9.83,19.05 10.83,18.3 12.58,18.3 12.72,18.44 U2.26 12.72,19.41 v13.08,19.05 | v7.58,19.05 7.2,18.68 | v19.58,17.55 21.83,17.55 22.83,18.55 22.83,20.22 U4.14
  Bottom 0.16: 11.86,26.27 11.35,25.76 R2.2 11.03,25.1 10.97,25.05 9.43,23.55 7.83,23.55 v6.83,22.55 | 11.86,26.27 RPI.5 | v6.58,26.55 11.58,26.55 11.86,26.27 | v9.83,19.05 v7.58,19.05 | v13.08,19.05 17.08,19.05 18.33,17.55 v19.58,17.55
SD0  (via drill 0.31)
  Top 0.16: U4.4 23.48,12.8 23.07,12.39 20.65,12.39 20.27,12 v20.27,8.83
  Bottom 0.16: v20.27,8.83 19.64,8.19 17.89,8.19 I2C-0.2
SD1
  Top 0.16: U4.6 24.78,11.81 23.83,10.86 23.83,8.58 24.21,8.19 25.05,8.19 I2C-1.2
SD2  (via drill 0.31)
  Top 0.16: v26.59,18.48 26.1,19.03 U4.9
  Bottom 0.16: I2C-2.2 31.96,8.17 30.83,9.3 30.83,11.05 30.33,11.55 27.58,11.55 26.83,12.3 26.83,18.05 26.59,18.29 v26.59,18.48
SD3  (via drill 0.31)
  Top 0.16: v26.4,21.55 25.08,21.55 24.83,21.3 24.83,20.29 U4.11
  Bottom 0.16: I2C-3.2 34.84,8.19 34.33,8.55 34.33,11.8 33.83,12.3 27.83,12.3 27.33,12.8 27.33,21.05 26.83,21.55 v26.4,21.55
SDA  (via drill 0.31)
  Top 0.16: U5.9 7.96,16.01 8.08,15.9 v10.58,15.9 | v12.08,19.05 12.08,20.14 U2.27 12.07,21.36 v11.81,21.61 | v11.45,29.55 11.08,29.55 8.08,29.55 7.58,29.05 7.58,27.05 7.94,26.69 U1.9 | RPI.3 v11.45,29.55 | v11.45,29.55 v11.44,29.54 | v16.08,26.8 16.08,25.29 R1.2 | v15.13,21.61 15.08,21.55 15.08,25.05 15.33,25.3 16.44,25.3 R1.2 | R1.2 21.03,25.1 22.2,24.04 22.2,20.48 U4.15
  Bottom 0.16: v10.58,15.9 12.08,17.55 v12.08,19.05 | v11.44,29.54 14.83,29.55 15.33,29.05 15.33,27.55 v16.08,26.8 | v11.81,21.61 v15.13,21.61
TXD  (via drill 0.31)
  Top 0.16: RPI.8 16.52,31.61 16.08,32.05 2.33,32.05 1.08,30.8 1.08,9.55 1.83,8.8 1.83,2.55 v2.58,1.55 | v44.83,1.8 45.83,2.8 45.83,4.66 1-WIRE.3
  Bottom 0.16: v2.58,1.55 2.83,1.3 44.33,1.3 v44.83,1.8
VCC_I2C_1
  Bottom 0.16: I2C-0.3 18.68,6.16 18.71,6.18 | 18.71,6.18 21.08,8.55 22.01,8.55 JP1.2 | I2C-1.3 18.71,6.18
VCC_I2C_2
  Bottom 0.16: JP2.2 30.44,8.68 30.83,8.3 30.83,6.55 31.33,6.05 32.11,6.05 I2C-2.3 39.43,6.17 I2C-3.3

### Text on the board
tPlace: A1- | A1+ | A1- | A1+ | 3.3v | GND | 1 | 1 | M1 | M2 | 5v | GND | 12v | GND | GND | RX TX | 6 | 8 | M3 | M4
bPlace: PiHAT-BIOTECH 1.2v | 3.3v | 3.3v | 2017 | Created by Nanusefue/nanusefue@gmail.com